# EAGLE design converter (EAGLE 6.4)
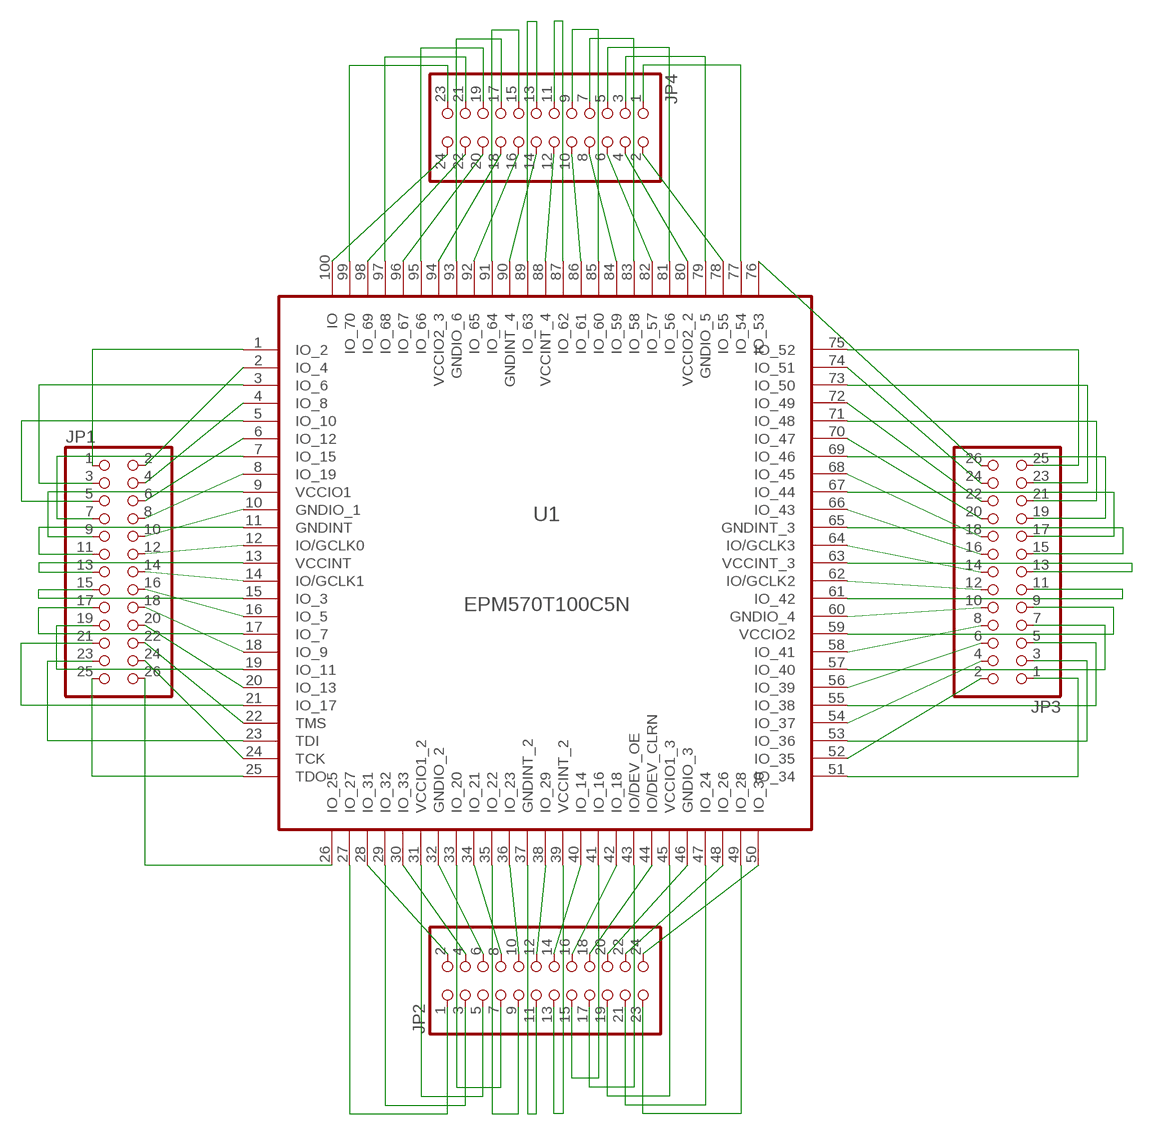
[diagram p0: schematic, sheet 1]

## Parts
JP1  PINHD-2X13  [2X13]
JP2  PINHD-2X12  [2X12]
JP3  PINHD-2X13  [2X13]
JP4  PINHD-2X12  [2X12]
U1  EPM570T100C5N  SQUARE-QFP  [QFP50P1600X1600X120-100N]

## Nets
N$1: JP1.1 U1.1(IO_2)
N$2: JP1.2 U1.2(IO_4)
N$3: JP1.3 U1.3(IO_6)
N$4: JP1.4 U1.4(IO_8)
N$5: JP1.5 U1.5(IO_10)
N$6: JP1.6 U1.6(IO_12)
N$7: JP1.7 U1.7(IO_15)
N$8: JP1.8 U1.8(IO_19)
N$9: JP1.9 U1.9(VCCIO1)
N$10: JP1.10 U1.10(GNDIO_1)
N$11: JP1.11 U1.11(GNDINT)
N$12: JP1.13 U1.13(VCCINT)
N$13: JP1.14 U1.14(IO/GCLK1)
N$14: JP1.15 U1.15(IO_3)
N$15: JP1.16 U1.16(IO_5)
N$16: JP1.17 U1.17(IO_7)
N$17: JP1.18 U1.18(IO_9)
N$18: JP1.19 U1.19(IO_11)
N$19: JP1.20 U1.20(IO_13)
N$20: JP1.21 U1.21(IO_17)
N$21: JP1.22 U1.22(TMS)
N$22: JP1.23 U1.23(TDI)
N$23: JP1.24 U1.24(TCK)
N$24: JP1.25 U1.25(TDO)
N$25: JP1.26 U1.26(IO_25)
N$26: JP2.1 U1.27(IO_27)
N$27: JP2.2 U1.28(IO_31)
N$28: JP2.3 U1.29(IO_32)
N$29: JP2.4 U1.30(IO_33)
N$30: JP2.5 U1.31(VCCIO1_2)
N$31: JP2.6 U1.32(GNDIO_2)
N$32: JP2.7 U1.33(IO_20)
N$33: JP2.8 U1.34(IO_21)
N$34: JP2.9 U1.35(IO_22)
N$35: JP2.10 U1.36(IO_23)
N$36: JP2.11 U1.37(GNDINT_2)
N$37: JP2.12 U1.38(IO_29)
N$38: JP2.13 U1.39(VCCINT_2)
N$39: JP2.15 U1.41(IO_16)
N$40: JP2.16 U1.42(IO_18)
N$41: JP2.17 U1.43(IO/DEV_OE)
N$42: JP2.18 U1.44(IO/DEV_CLRN)
N$43: JP2.19 U1.45(VCCIO1_3)
N$44: JP2.20 U1.46(GNDIO_3)
N$45: JP2.21 U1.47(IO_24)
N$46: JP2.22 U1.48(IO_26)
N$47: JP2.23 U1.49(IO_28)
N$48: JP2.24 U1.50(IO_30)
N$49: JP3.1 U1.51(IO_34)
N$50: JP3.2 U1.52(IO_35)
N$51: JP3.3 U1.53(IO_36)
N$52: JP3.4 U1.54(IO_37)
N$53: JP3.5 U1.55(IO_38)
N$54: JP3.6 U1.56(IO_39)
N$55: JP3.7 U1.57(IO_40)
N$56: JP3.8 U1.58(IO_41)
N$57: JP3.9 U1.59(VCCIO2)
N$58: JP3.10 U1.60(GNDIO_4)
N$59: JP3.11 U1.61(IO_42)
N$60: JP3.12 U1.62(IO/GCLK2)
N$61: JP3.13 U1.63(VCCINT_3)
N$62: JP3.14 U1.64(IO/GCLK3)
N$63: JP3.15 U1.65(GNDINT_3)
N$64: JP3.16 U1.66(IO_43)
N$65: JP3.17 U1.67(IO_44)
N$66: JP3.19 U1.69(IO_46)
N$67: JP3.20 U1.70(IO_47)
N$68: JP3.21 U1.71(IO_48)
N$69: JP3.22 U1.72(IO_49)
N$70: JP3.23 U1.73(IO_50)
N$71: JP3.24 U1.74(IO_51)
N$72: JP3.25 U1.75(IO_52)
N$73: JP3.26 U1.76(IO_53)
N$74: JP4.1 U1.77(IO_54)
N$75: JP4.2 U1.78(IO_55)
N$76: JP4.3 U1.79(GNDIO_5)
N$77: JP4.4 U1.80(VCCIO2_2)
N$78: JP4.5 U1.81(IO_56)
N$79: JP4.6 U1.82(IO_57)
N$80: JP4.7 U1.83(IO_58)
N$81: JP4.8 U1.84(IO_59)
N$82: JP4.9 U1.85(IO_60)
N$83: JP4.10 U1.86(IO_61)
N$84: JP4.11 U1.87(IO_62)
N$85: JP4.12 U1.88(VCCINT_4)
N$86: JP4.13 U1.89(IO_63)
N$87: JP4.15 U1.91(IO_64)
N$88: JP4.16 U1.92(IO_65)
N$89: JP4.17 U1.93(GNDIO_6)
N$90: JP4.18 U1.94(VCCIO2_3)
N$91: JP4.19 U1.95(IO_66)
N$92: JP4.20 U1.96(IO_67)
N$93: JP4.21 U1.97(IO_68)
N$94: JP4.22 U1.98(IO_69)
N$95: JP4.23 U1.99(IO_70)
N$96: JP4.24 U1.100(IO)
N$97: JP1.12 U1.12(IO/GCLK0)
N$98: JP2.14 U1.40(IO_14)
N$99: JP3.18 U1.68(IO_45)
N$100: JP4.14 U1.90(GNDINT_4)

## Library data of the parts
JP1 JP3 = pinhead:PINHD-2X13: PIN HEADER
JP2 JP4 = pinhead:PINHD-2X12: PIN HEADER
U1 = epm570t100:SQUARE-QFP

## Board
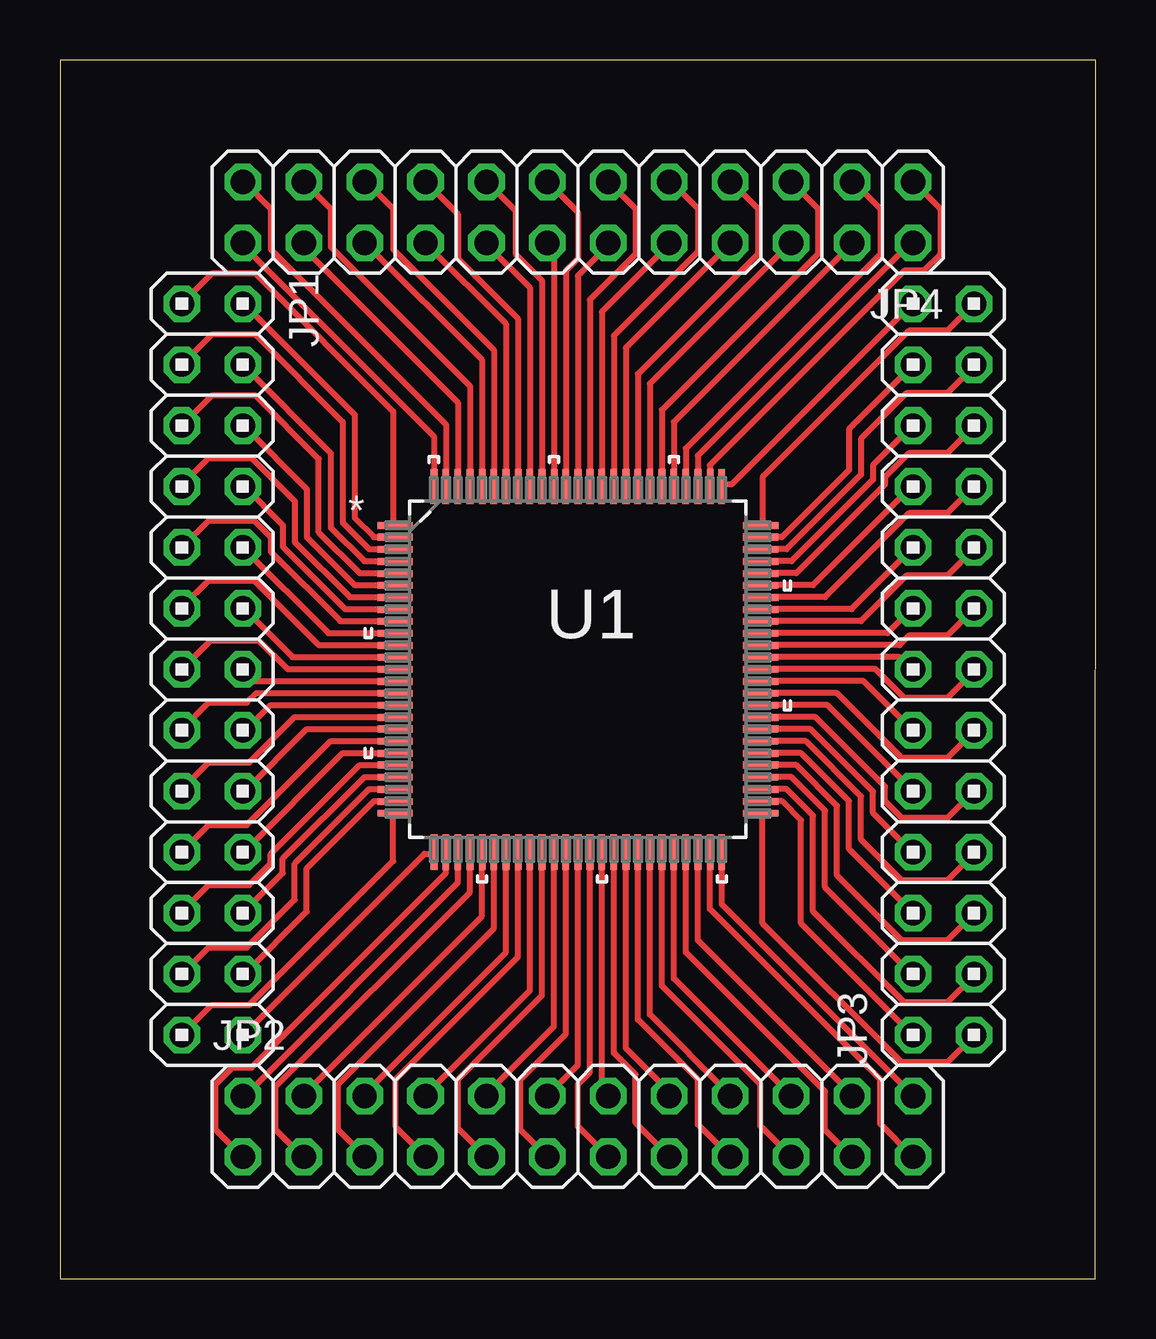
[diagram p1: board, top side]

Size 43.18 x 50.8 mm. Coordinates in mm from the lower left corner, seen from the top.
Outline: 0,0 43.16,0 43.18,50.8 0,50.8 0,0
Copper layers (1*16): Top 0.035mm / dielectric 1.5mm / Bottom 0.035mm
Design rules "default": minimum track width 10mil, minimum drill 24mil, track to track 8mil, track to pad 8mil, pad to pad 8mil, via to via 8mil, smd to smd 8mil, copper to edge 40mil, drill to drill 8mil, minimum pad ring 10mil, minimum via ring 8mil, stop-mask expansion 4mil, vias tented up to drill 0mil, thermal gap 10mil

### Footprints (pad centres in the part's own frame; a part is rotated, then mirrored left to right if it is on the bottom)
2X13 = drill 1.016 octagon: 1 -15.24,-1.27; 2 -15.24,1.27; 3 -12.7,-1.27; 4 -12.7,1.27; 5 -10.16,-1.27; 6 -10.16,1.27; 7 -7.62,-1.27; 8 -7.62,1.27; 9 -5.08,-1.27; 10 -5.08,1.27; 11 -2.54,-1.27; 12 -2.54,1.27; 13 0,-1.27; 14 0,1.27; 15 2.54,-1.27; 16 2.54,1.27; 17 5.08,-1.27; 18 5.08,1.27; 19 7.62,-1.27; 20 7.62,1.27; 21 10.16,-1.27; 22 10.16,1.27; 23 12.7,-1.27; 24 12.7,1.27; 25 15.24,-1.27; 26 15.24,1.27
2X12 = drill 1.016 octagon: 1 -13.97,-1.27; 2 -13.97,1.27; 3 -11.43,-1.27; 4 -11.43,1.27; 5 -8.89,-1.27; 6 -8.89,1.27; 7 -6.35,-1.27; 8 -6.35,1.27; 9 -3.81,-1.27; 10 -3.81,1.27; 11 -1.27,-1.27; 12 -1.27,1.27; 13 1.27,-1.27; 14 1.27,1.27; 15 3.81,-1.27; 16 3.81,1.27; 17 6.35,-1.27; 18 6.35,1.27; 19 8.89,-1.27; 20 8.89,1.27; 21 11.43,-1.27; 22 11.43,1.27; 23 13.97,-1.27; 24 13.97,1.27
QFP50P1600X1600X120-100N = smd 1.473 x 0.279: 1 -7.62,5.994; 2 -7.62,5.512; 3 -7.62,5.004; 4 -7.62,4.496; 5 -7.62,3.988; 6 -7.62,3.505; 7 -7.62,2.997; 8 -7.62,2.489; 9 -7.62,2.007; 10 -7.62,1.499; 11 -7.62,0.991; 12 -7.62,0.508; 13 -7.62,0; 14 -7.62,-0.508; 15 -7.62,-0.991; 16 -7.62,-1.499; 17 -7.62,-2.007; 18 -7.62,-2.489; 19 -7.62,-2.997; 20 -7.62,-3.505; 21 -7.62,-3.988; 22 -7.62,-4.496; 23 -7.62,-5.004; 24 -7.62,-5.512; 25 -7.62,-5.994; 51 7.62,-5.994; 52 7.62,-5.512; 53 7.62,-5.004; 54 7.62,-4.496; 55 7.62,-3.988; 56 7.62,-3.505; 57 7.62,-2.997; 58 7.62,-2.489; 59 7.62,-2.007; 60 7.62,-1.499; 61 7.62,-0.991; 62 7.62,-0.508; 63 7.62,0; 64 7.62,0.508; 65 7.62,0.991; 66 7.62,1.499; 67 7.62,2.007; 68 7.62,2.489; 69 7.62,2.997; 70 7.62,3.505; 71 7.62,3.988; 72 7.62,4.496; 73 7.62,5.004; 74 7.62,5.512; 75 7.62,5.994 | smd 0.279 x 1.473: 26 -5.994,-7.62; 27 -5.512,-7.62; 28 -5.004,-7.62; 29 -4.496,-7.62; 30 -3.988,-7.62; 31 -3.505,-7.62; 32 -2.997,-7.62; 33 -2.489,-7.62; 34 -2.007,-7.62; 35 -1.499,-7.62; 36 -0.991,-7.62; 37 -0.508,-7.62; 38 0,-7.62; 39 0.508,-7.62; 40 0.991,-7.62; 41 1.499,-7.62; 42 2.007,-7.62; 43 2.489,-7.62; 44 2.997,-7.62; 45 3.505,-7.62; 46 3.988,-7.62; 47 4.496,-7.62; 48 5.004,-7.62; 49 5.512,-7.62; 50 5.994,-7.62; 76 5.994,7.62; 77 5.512,7.62; 78 5.004,7.62; 79 4.496,7.62; 80 3.988,7.62; 81 3.505,7.62; 82 2.997,7.62; 83 2.489,7.62; 84 2.007,7.62; 85 1.499,7.62; 86 0.991,7.62; 87 0.508,7.62; 88 0,7.62; 89 -0.508,7.62; 90 -0.991,7.62; 91 -1.499,7.62; 92 -2.007,7.62; 93 -2.489,7.62; 94 -2.997,7.62; 95 -3.505,7.62; 96 -3.988,7.62; 97 -4.496,7.62; 98 -5.004,7.62; 99 -5.512,7.62; 100 -5.994,7.62

### Placement (x,y rotation side)
JP1  6.35,25.4 270 top
JP2  21.59,6.35 0 top
JP3  36.83,25.4 90 top
JP4  21.59,44.45 180 top
U1  21.59,25.4 0 top

### Tracks (layer width: path | path; a pad name or v marks a point on that pad's centre or on a via)
N$1
  Top 0.254: JP1.1 6.35,41.91 8.13,41.91 13.89,36.15 13.89,31.41 U1.1
N$2
  Top 0.254: U1.2 13.89,30.91 13.09,30.91 12.29,31.71 12.29,36.01 7.69,40.61 JP1.2
N$3
  Top 0.254: JP1.3 6.35,39.37 8.13,39.37 8.19,39.31 11.79,35.71 11.79,31.51 12.89,30.41 13.89,30.41 U1.3
N$4
  Top 0.254: U1.4 13.89,29.91 12.69,29.91 11.29,31.31 11.29,34.41 7.69,38.01 JP1.4
N$5
  Top 0.254: JP1.5 6.35,36.83 8.13,36.83 10.79,34.17 10.79,31.11 12.49,29.41 13.89,29.41 U1.5
N$6
  Top 0.254: U1.6 13.89,28.91 12.29,28.91 10.29,30.91 10.29,32.91 7.69,35.51 JP1.6
N$7
  Top 0.254: 13.89,28.41 U1.7 13.79,28.41 12.09,28.41 9.79,30.71 9.79,32.41 7.99,34.21 6.19,34.21 5.09,33.11 JP1.7
N$8
  Top 0.254: U1.8 13.89,27.91 11.89,27.91 9.29,30.51 9.29,31.41 7.69,33.01 JP1.8
N$9
  Top 0.254: U1.9 13.89,27.41 11.69,27.41 8.79,30.31 8.79,30.91 8.09,31.61 6.19,31.61 5.09,30.51 JP1.9
N$10
  Top 0.254: JP1.10 11.19,26.91 13.89,26.91 U1.10
N$11
  Top 0.254: U1.11 13.89,26.41 10.79,26.41 8.09,29.11 6.19,29.11 5.09,28.01 JP1.11
N$12
  Top 0.254: JP1.13 6.29,26.61 8.29,26.61 9.49,25.41 13.89,25.41 U1.13
N$13
  Top 0.254: U1.14 13.89,24.91 8.09,24.91 7.69,25.31 JP1.14
N$14
  Top 0.254: U1.15 13.89,24.41 8.19,24.41 7.79,24.01 6.19,24.01 5.09,22.91 JP1.15
N$15
  Top 0.254: U1.16 13.89,23.91 8.79,23.91 7.69,22.81 JP1.16
N$16
  Top 0.254: U1.17 13.89,23.41 9.79,23.41 7.89,21.51 6.19,21.51 5.09,20.41 JP1.17
N$17
  Top 0.254: U1.18 13.89,22.91 10.29,22.91 7.69,20.31 JP1.18
N$18
  Top 0.254: U1.19 13.89,22.41 11.29,22.41 7.79,18.91 6.19,18.91 5.09,17.81 JP1.19
N$19
  Top 0.254: U1.20 13.89,21.91 11.79,21.91 7.69,17.81 JP1.20
N$20
  Top 0.254: U1.21 13.89,21.41 12.49,21.41 8.79,17.71 8.79,17.31 7.89,16.41 6.19,16.41 5.09,15.31 JP1.21
N$21
  Top 0.254: JP1.22 9.29,16.91 9.29,17.51 12.69,20.91 13.89,20.91 U1.22
N$22
  Top 0.254: JP1.23 6.19,13.81 7.79,13.81 9.79,15.81 9.79,17.31 12.89,20.41 13.89,20.41 U1.23
N$23
  Top 0.254: U1.24 13.89,19.91 13.09,19.91 10.29,17.11 10.29,15.31 7.69,12.71 JP1.24
N$24
  Top 0.254: JP1.25 6.33,11.41 7.89,11.41 13.89,17.41 13.89,19.31 U1.25
N$25
  Top 0.254: U1.26 15.59,17.71 15.19,17.71 7.69,10.21 JP1.26
N$26
  Top 0.254: JP2.1 6.49,6.21 6.49,8.11 7.19,8.81 7.99,8.81 16.09,16.91 16.09,17.71 U1.27
N$27
  Top 0.254: U1.28 16.59,17.71 16.59,16.51 7.69,7.61 JP2.2
N$28
  Top 0.254: U1.29 17.09,17.71 17.09,16.11 8.99,8.01 8.99,6.21 10.09,5.11 JP2.3
N$29
  Top 0.254: U1.30 17.59,17.71 17.59,15.11 10.19,7.71 JP2.4
N$30
  Top 0.254: U1.31 18.09,17.71 18.09,14.61 11.59,8.11 11.59,6.21 12.69,5.11 JP2.5
N$31
  Top 0.254: U1.32 18.59,17.71 18.59,13.61 12.69,7.71 JP2.6
N$32
  Top 0.254: JP2.7 13.99,6.33 13.99,8.31 19.09,13.41 19.09,17.71 U1.33
N$33
  Top 0.254: U1.34 19.59,17.71 19.59,12.01 15.29,7.71 JP2.8
N$34
  Top 0.254: JP2.9 16.59,6.27 16.59,8.31 20.09,11.81 20.09,17.71 U1.35
N$35
  Top 0.254: U1.36 20.59,17.71 20.59,10.51 17.79,7.71 JP2.10
N$36
  Top 0.254: JP2.11 19.19,6.21 19.19,8.31 21.09,10.21 21.09,17.71 U1.37
N$37
  Top 0.254: U1.38 21.59,8.91 20.39,7.71 JP2.12
N$38
  Top 0.254: JP2.13 21.59,6.35 21.59,8.11 22.09,8.61 22.09,17.71 U1.39
N$39
  Top 0.254: JP2.15 23.99,6.49 23.99,8.51 23.09,9.41 23.09,17.71 U1.41
N$40
  Top 0.254: U1.42 23.59,17.71 23.59,9.61 25.49,7.71 JP2.16
N$41
  Top 0.254: JP2.17 26.59,6.43 26.59,8.31 24.09,10.81 24.09,17.71 U1.43
N$42
  Top 0.254: U1.44 24.59,17.71 24.59,11.01 27.89,7.71 JP2.18
N$43
  Top 0.254: JP2.19 29.19,6.37 29.19,8.11 25.09,12.21 25.09,17.71 U1.45
N$44
  Top 0.254: JP2.20 25.59,12.51 25.59,17.71 U1.46
N$45
  Top 0.254: JP2.21 31.89,6.21 31.89,7.81 26.09,13.61 26.09,17.71 U1.47
N$46
  Top 0.254: U1.48 26.59,17.71 26.59,14.11 32.99,7.71 JP2.22
N$47
  Top 0.254: JP2.23 34.19,6.45 34.19,8.31 27.09,15.41 27.09,17.71 U1.49
N$48
  Top 0.254: U1.50 27.59,17.71 27.59,15.61 35.49,7.71 JP2.24
N$49
  Top 0.254: U1.51 29.29,19.31 29.29,14.81 35.09,9.01 36.99,9.01 38.09,10.11 JP3.1
N$50
  Top 0.254: U1.52 29.29,19.91 30.09,19.91 30.89,19.11 30.89,14.81 35.49,10.21 JP3.2
N$51
  Top 0.254: U1.53 29.29,20.41 30.29,20.41 31.39,19.31 31.39,15.31 35.19,11.51 36.99,11.51 38.09,12.61 JP3.3
N$52
  Top 0.254: U1.54 29.29,20.91 30.49,20.91 31.89,19.51 31.89,16.31 35.49,12.71 JP3.4
N$53
  Top 0.254: U1.55 29.29,21.41 30.69,21.41 32.39,19.71 32.39,16.81 35.09,14.11 36.99,14.11 38.09,15.21 JP3.5
N$54
  Top 0.254: JP3.6 32.89,17.91 32.89,19.91 30.89,21.91 29.29,21.91 U1.56
N$55
  Top 0.254: U1.57 29.29,22.41 31.09,22.41 33.39,20.11 33.39,18.31 35.09,16.61 36.99,16.61 38.09,17.71 JP3.7
N$56
  Top 0.254: U1.58 29.29,22.91 31.29,22.91 33.89,20.31 33.89,19.41 35.49,17.81 JP3.8
N$57
  Top 0.254: JP3.9 36.99,19.21 35.09,19.21 34.39,19.91 34.39,20.51 31.49,23.41 29.29,23.41 U1.59
N$58
  Top 0.254: U1.60 29.29,23.91 31.99,23.91 35.49,20.41 JP3.10
N$59
  Top 0.254: U1.61 29.29,24.41 32.39,24.41 35.09,21.71 36.99,21.71 38.09,22.81 JP3.11
N$60
  Top 0.254: U1.62 29.29,24.91 33.49,24.91 35.49,22.91 JP3.12
N$61
  Top 0.254: U1.63 29.29,25.41 33.99,25.41 35.19,24.21 36.99,24.21 38.09,25.31 JP3.13
N$62
  Top 0.254: U1.64 29.29,25.91 34.99,25.91 35.49,25.41 JP3.14
N$63
  Top 0.254: U1.65 29.29,26.41 34.99,26.41 35.39,26.81 36.99,26.81 38.09,27.91 JP3.15
N$64
  Top 0.254: U1.66 29.29,26.91 34.49,26.91 35.49,27.91 JP3.16
N$65
  Top 0.254: U1.67 29.29,27.41 33.39,27.41 35.29,29.31 36.99,29.31 38.09,30.41 JP3.17
N$66
  Top 0.254: JP3.19 36.99,31.91 35.39,31.91 31.89,28.41 29.29,28.41 U1.69
N$67
  Top 0.254: U1.70 29.29,28.91 31.39,28.91 35.49,33.01 JP3.20
N$68
  Top 0.254: U1.71 29.29,29.41 30.69,29.41 34.39,33.11 34.39,33.41 35.39,34.41 36.99,34.41 38.09,35.51 JP3.21
N$69
  Top 0.254: U1.72 29.29,29.91 30.49,29.91 33.89,33.31 33.89,33.91 35.49,35.51 JP3.22
N$70
  Top 0.254: U1.73 29.29,30.41 30.29,30.41 33.39,33.51 33.39,35.01 35.29,36.91 36.99,36.91 38.09,38.01 JP3.23
N$71
  Top 0.254: U1.74 29.29,30.91 30.09,30.91 32.89,33.71 32.89,35.41 35.49,38.01 JP3.24
N$72
  Top 0.254: U1.75 29.29,31.41 29.29,33.41 35.39,39.51 36.99,39.51 38.09,40.61 JP3.25
N$73
  Top 0.254: U1.76 27.59,33.11 27.99,33.11 35.49,40.61 JP3.26
N$74
  Top 0.254: U1.77 27.09,33.11 27.09,33.91 35.19,42.01 35.99,42.01 36.69,42.71 36.69,44.61 35.59,45.71 JP4.1
N$75
  Top 0.254: U1.78 26.59,33.11 26.59,34.31 35.49,43.21 JP4.2
N$76
  Top 0.254: U1.79 26.09,33.11 26.09,34.61 34.19,42.71 34.19,44.61 33.09,45.71 JP4.3
N$77
  Top 0.254: U1.80 25.59,33.11 25.59,35.71 32.99,43.11 JP4.4
N$78
  Top 0.254: JP4.5 31.59,44.61 31.59,42.71 25.09,36.21 25.09,33.11 U1.81
N$79
  Top 0.254: U1.82 24.59,33.11 24.59,37.31 30.39,43.11 JP4.6
N$80
  Top 0.254: U1.83 24.09,33.11 24.09,37.71 29.09,42.71 29.09,44.61 27.99,45.71 JP4.7
N$81
  Top 0.254: U1.84 23.59,33.11 23.59,38.81 27.89,43.11 JP4.8
N$82
  Top 0.254: U1.85 23.09,33.11 23.09,39.31 26.59,42.81 26.59,44.61 25.49,45.71 JP4.9
N$83
  Top 0.254: U1.86 22.59,33.11 22.59,40.31 25.39,43.11 JP4.10
N$84
  Top 0.254: U1.87 22.09,33.11 22.09,40.81 23.99,42.71 23.99,44.61 22.89,45.71 JP4.11
N$85
  Top 0.254: U1.88 21.59,41.81 22.89,43.11 JP4.12
N$86
  Top 0.254: JP4.13 21.59,44.45 21.59,42.51 21.09,42.01 21.09,33.11 U1.89
N$87
  Top 0.254: JP4.15 18.99,44.51 18.99,42.71 20.09,41.61 20.09,33.11 U1.91
N$88
  Top 0.254: U1.92 19.59,33.11 19.59,41.31 17.79,43.11 JP4.16
N$89
  Top 0.254: JP4.17 16.59,44.37 16.59,42.51 19.09,40.01 19.09,33.11 U1.93
N$90
  Top 0.254: U1.94 18.59,33.11 18.59,39.81 15.29,43.11 JP4.18
N$91
  Top 0.254: U1.95 18.09,33.11 18.09,38.71 13.89,42.91 13.89,44.61 12.79,45.71 JP4.19
N$92
  Top 0.254: U1.96 17.59,33.11 17.59,38.31 12.79,43.11 JP4.20
N$93
  Top 0.254: U1.97 17.09,33.11 17.09,37.21 11.29,43.01 11.29,44.61 10.19,45.71 JP4.21
N$94
  Top 0.254: U1.98 16.59,33.11 16.59,36.51 10.19,42.91 10.19,43.11 JP4.22
N$95
  Top 0.254: U1.99 16.09,33.11 16.09,35.61 8.79,42.91 8.79,44.61 7.69,45.71 JP4.23
N$96
  Top 0.254: U1.100 15.59,33.11 15.59,35.11 7.59,43.11 JP4.24
N$97
  Top 0.254: U1.12 13.89,25.91 9.69,25.91 7.69,27.91 JP1.12
N$98
  Top 0.254: U1.40 22.59,17.71 22.59,7.91 22.79,7.71 JP2.14
N$99
  Top 0.254: JP3.18 32.99,27.91 29.29,27.91 U1.68
N$100
  Top 0.254: JP4.14 20.59,42.91 20.59,33.11 U1.90